# EAGLE design v0.9.1 (EAGLE 9.3.0)
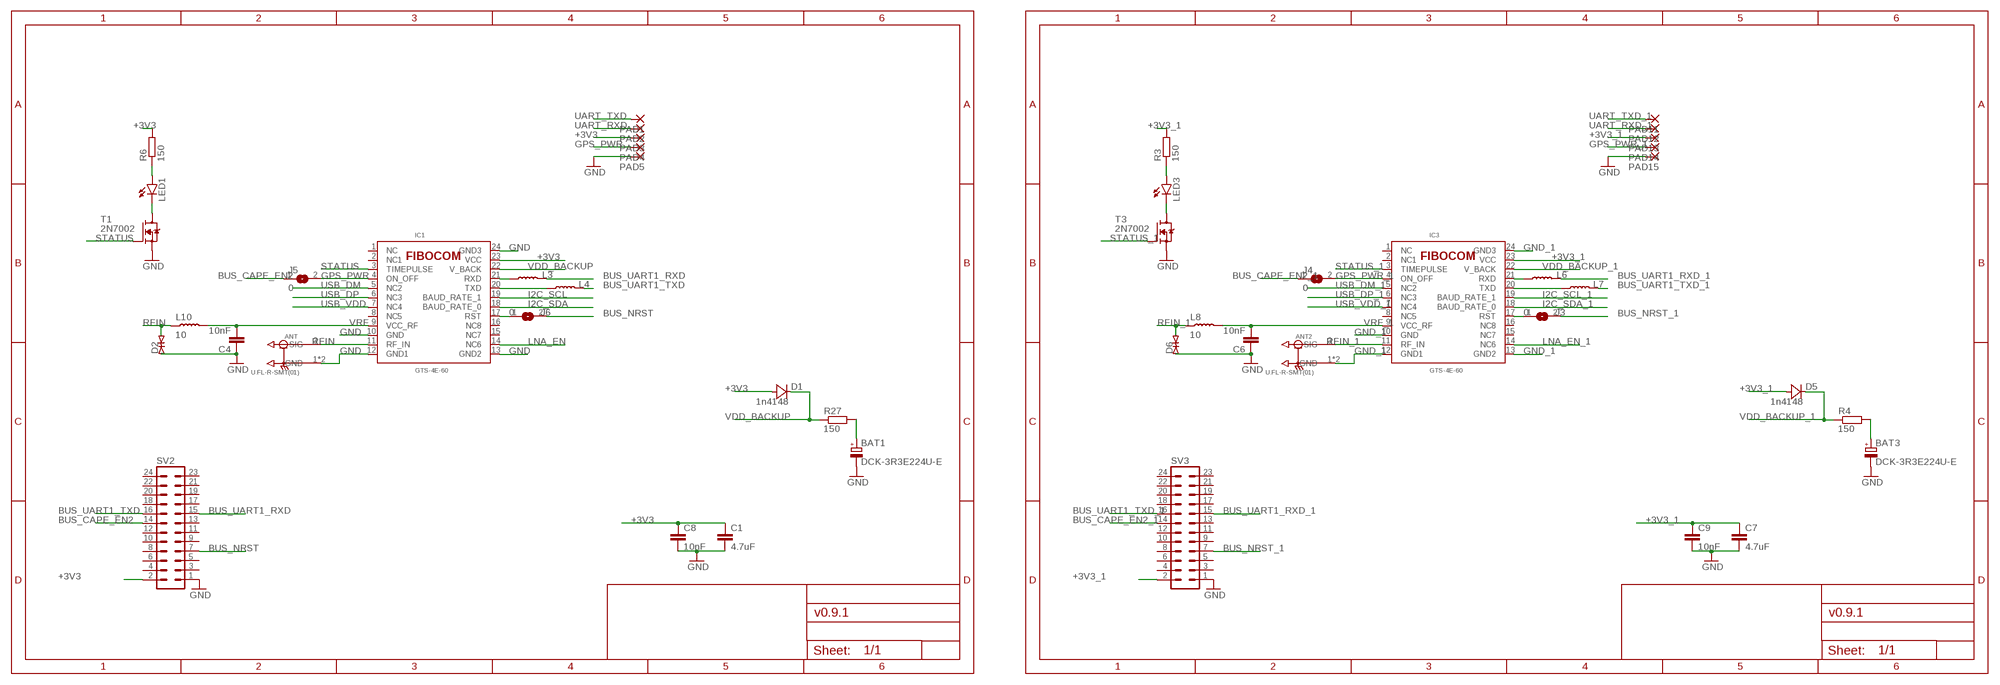
[diagram p0: schematic, sheet 1]

## Parts
ANT  U.FL-R-SMT(01)  [HRS_U.FL-R-SMT(01)]
ANT2  U.FL-R-SMT(01)  [HRS_U.FL-R-SMT(01)]
BAT1  DCK-3R3E224U-E  [621]
BAT3  DCK-3R3E224U-E  [621]
C1  4.7uF  CAP-0603  [C0603]
C4  10nF  CAP-0402  [C0402K]
C6  10nF  CAP-0402  [C0402K]
C7  4.7uF  CAP-0603  [C0603]
C8  10nF  CAP-0603  [C0603]
C9  10nF  CAP-0603  [C0603]
D1  1n4148  1N4148WS  [SOD323]
D2  ESD9B5.0ST5G  [SOD1006X40]
D5  1n4148  1N4148WS  [SOD323]
D6  ESD9B5.0ST5G  [SOD1006X40]
IC1  GTS-4E-60  [_GTS_4E_60]
IC3  GTS-4E-60  [_GTS_4E_60]
J3  0  JUMP-0603  [C0603]
J4  0  JUMP-0603  [C0603]
J5  0  JUMP-0603  [C0603]
J6  0  JUMP-0603  [C0603]
L3  blm15  IND-0402  [L0402]
L4  blm15  IND-0402  [L0402]
L6  blm15  IND-0402  [L0402]
L7  blm15  IND-0402  [L0402]
L8  10  IND-0402  [L0402]
L10  10  IND-0402  [L0402]
LED1  LEDCHIP-LED0603  [CHIP-LED0603]
LED3  LEDCHIP-LED0603  [CHIP-LED0603]
PAD1  1,6/0,9  [1,6/0,9]
PAD2  1,6/0,9  [1,6/0,9]
PAD3  1,6/0,9  [1,6/0,9]
PAD4  1,6/0,9  [1,6/0,9]
PAD5  1,6/0,9  [1,6/0,9]
PAD11  1,6/0,9  [1,6/0,9]
PAD12  1,6/0,9  [1,6/0,9]
PAD13  1,6/0,9  [1,6/0,9]
PAD14  1,6/0,9  [1,6/0,9]
PAD15  1,6/0,9  [1,6/0,9]
R3  150  RES-0603  [R0603]
R4  150  RES-0603  [R0603]
R6  150  RES-0603  [R0603]
R27  150  RES-0603  [R0603]
SV2  MA12-2  [MA12-2]
SV3  MA12-2  [MA12-2]
T1  2N7002  [SOT95P240X110-3]
T3  2N7002  [SOT95P240X110-3]

## Nets
+3V3: C1.1 C8.1 D1.A IC1.23(VCC) PAD3.1(P) R6.2 SV2.2
+3V3_1: C7.1 C9.1 D5.A IC3.23(VCC) PAD13.1(P) R3.2 SV3.2
BUS_CAPE_EN2: J5.1 SV2.14
BUS_CAPE_EN2_1: J4.1 SV3.14
BUS_NRST: J6.2 SV2.7
BUS_NRST_1: J3.2 SV3.7
BUS_UART1_RXD: L3.2 SV2.15
BUS_UART1_RXD_1: L6.2 SV3.15
BUS_UART1_TXD: L4.2 SV2.16
BUS_UART1_TXD_1: L7.2 SV3.16
GND: ANT.1(GND) ANT.2(GND) BAT1.- C1.2 C4.1 C8.2 D2.1(A) IC1.10(GND) IC1.12(GND1) IC1.13(GND2) IC1.24(GND3) PAD5.1(P) SV2.1 T1.2(S)
GND_1: ANT2.1(GND) ANT2.2(GND) BAT3.- C6.1 C7.2 C9.2 D6.1(A) IC3.10(GND) IC3.12(GND1) IC3.13(GND2) IC3.24(GND3) PAD15.1(P) SV3.1 T3.2(S) ; supply symbol labelled GND
GPS_PWR: IC1.4(ON_OFF) J5.2 PAD4.1(P)
GPS_PWR_1: IC3.4(ON_OFF) J4.2 PAD14.1(P)
I2C_SCL: IC1.19(BAUD_RATE_1)
I2C_SCL_1: IC3.19(BAUD_RATE_1)
I2C_SDA: IC1.18(BAUD_RATE_0)
I2C_SDA_1: IC3.18(BAUD_RATE_0)
LNA_EN: IC1.14(NC6)
LNA_EN_1: IC3.14(NC6)
N$5: BAT3.+ R4.2
N$6: LED1.C T1.3(D)
N$7: IC3.17(RST) J3.1
N$8: IC1.17(RST) J6.1
N$9: LED3.C T3.3(D)
N$10: LED3.A R3.1
N$12: LED1.A R6.1
N$20: BAT1.+ R27.2
RFIN: ANT.3(SIG) D2.2(C) IC1.11(RF_IN) L10.1
RFIN_1: ANT2.3(SIG) D6.2(C) IC3.11(RF_IN) L8.1
STATUS: IC1.3(TIMEPULSE) T1.1(G)
STATUS_1: IC3.3(TIMEPULSE) T3.1(G)
UART_RXD: IC1.20(TXD) L4.1 PAD2.1(P)
UART_RXD_1: IC3.20(TXD) L7.1 PAD12.1(P)
UART_TXD: IC1.21(RXD) L3.1 PAD1.1(P)
UART_TXD_1: IC3.21(RXD) L6.1 PAD11.1(P)
USB_DM: IC1.5(NC2)
USB_DM_1: IC3.5(NC2)
USB_DP: IC1.6(NC3)
USB_DP_1: IC3.6(NC3)
USB_VDD: IC1.7(NC4)
USB_VDD_1: IC3.7(NC4)
VDD_BACKUP: D1.K(C) IC1.22(V_BACK) R27.1
VDD_BACKUP_1: D5.K(C) IC3.22(V_BACK) R4.1
VRF: C4.2 IC1.9(VCC_RF) L10.2
VRF_1: C6.2 IC3.9(VCC_RF) L8.2
Unconnected: IC1.1(NC) IC1.2(NC1) IC1.8(NC5) IC1.15(NC7) IC1.16(NC8) IC3.1(NC) IC3.2(NC1) IC3.8(NC5) IC3.15(NC7) IC3.16(NC8) SV2.3 SV2.4 SV2.5 SV2.6 SV2.8 SV2.9 SV2.10 SV2.11 SV2.12 SV2.13 SV2.17 SV2.18 SV2.19 SV2.20 SV2.21 SV2.22 SV2.23 SV2.24 SV3.3 SV3.4 SV3.5 SV3.6 SV3.8 SV3.9 SV3.10 SV3.11 SV3.12 SV3.13 SV3.17 SV3.18 SV3.19 SV3.20 SV3.21 SV3.22 SV3.23 SV3.24

## Library data of the parts
ANT ANT2 = parts-molex:U.FL-R-SMT(01): U.FL Series 6 Ghz 50 Ohm Ultra-small SMT Coaxial Cable Receptacle; AVAILABILITY: Unavailable; DESCRIPTION: U.FL Series 6 Ghz 50 Ohm Ultra-small SMT Coaxial Cable Receptacle; MF: Hirose; MP: U.FL-R-SMT_01_; PACKAGE: None; PRICE: None
BAT1 BAT3 = parts-elna:DCK-3R3E224U-E
C1 C7-C9 = parts-passives:CAP-; PACKAGE: 0603; RATING: 10V
C4 C6 = parts-passives:CAP-; PACKAGE: 0402; RATING: 6V
D1 D5 = parts-diotec:1N4148WS
D2 D6 = parts-onsemi:ESD9B
IC1 IC3 = parts-fibocom:GTS-4E-60: The GTS-4E is a new generation of GPS receiving module. FIBOCOM GTS 4E 60
J3-J6 = parts-helpers:JUMP-
L3 L4 L6-L8 L10 = parts-passives:IND-; CURRENT: 10mA; PACKAGE: 0402
LED1 LED3 = led:LED: LED OSRAM: - CHIPLED LG R971, LG N971, LY N971, LG Q971, LY Q971, LO R971, LY R971 LH N974, LH R974 LS Q976, LO Q976, LY Q976 LO Q996 - Hyper CHIPLED LW Q18S LB Q993, LB Q99A, LB R99A - SideLED LS A670, LO A670, LY A670, LG A670, LP A670 LB A673, LV A673, LT A673, LW A673 LH A674 LY A675 LS A676, LA A676, LO A676, LY A676, LW A676 LS A679, LY A679, LG A679 - Hyper Micro SIDELED® LS Y876, LA Y876, LO Y876, LY Y876 LT Y87S - SmartLED LW L88C, LW L88S LB L89C, LB L89S, LG L890 LS L89K, LO L89K, LY L89K LS L896, LA L896, LO L896, LY L896 - TOPLED LS T670, LO T670, LY T670, LG T670, LP T670 LSG T670, LSP T670, LSY T670, LOP T670, LYG T670 LG T671, LOG T671, LSG T671 LB T673, LV T673, LT T673, LW T673 LH T674 LS T676, LA T676, LO T676, LY T676, LB T676, LH T676, LSB T676, LW T676 LB T67C, LV T67C, LT T67C, LS T67K, LO T67K, LY T67K, LW E67C LS E67B, LA E67B, LO E67B, LY E67B, LB E67C, LV E67C, LT E67C LW T67C LS T679, LY T679, LG T679 LS T770, LO T770, LY T770, LG T770, LP T770 LB T773, LV T773, LT T773, LW T773 LH T774 LS E675, LA E675, LY E675, LS T675 LS T776, LA T776, LO T776, LY T776, LB T776 LHGB T686 LT T68C, LB T68C - Hyper Mini TOPLED® LB M676 - Mini TOPLED Santana® LG M470 LS M47K, LO M47K, LY M47K Source: http://www.osram.convergy.de LUXEON: - LUMILED® LXK2-PW12-R00, LXK2-PW12-S00, LXK2-PW14-U00, LXK2-PW14-V00 LXK2-PM12-R00, LXK2-PM12-S00, LXK2-PM14-U00 LXK2-PE12-Q00, LXK2-PE12-R00, LXK2-PE12-S00, LXK2-PE14-T00, LXK2-PE14-U00 LXK2-PB12-K00, LXK2-PB12-L00, LXK2-PB12-M00, LXK2-PB14-N00, LXK2-PB14-P00, LXK2-PB14-Q00 LXK2-PR12-L00, LXK2-PR12-M00, LXK2-PR14-Q00, LXK2-PR14-R00 LXK2-PD12-Q00, LXK2-PD12-R00, LXK2-PD12-S00 LXK2-PH12-R00, LXK2-PH12-S00 LXK2-PL12-P00, LXK2-PL12-Q00, LXK2-PL12-R00 Source: www.luxeon.com KINGBRIGHT: KA-3528ASYC Source: www.kingbright.com
PAD1-PAD5 PAD11-PAD15 = wirepad:1,6/0,9: THROUGH-HOLE PAD
R3 R4 R6 R27 = parts-passives:RES-; PACKAGE: 0603
SV2 SV3 = con-lstb:MA12-2: PIN HEADER; OC_FARNELL: unknown; OC_NEWARK: unknown
T1 T3 = parts-onsemi:2N7002

## Net classes
1 50_feed: width 1 mm, clearance 0.4 mm
2 usb_dif: width 0.4 mm, clearance 0.8 mm

## Board
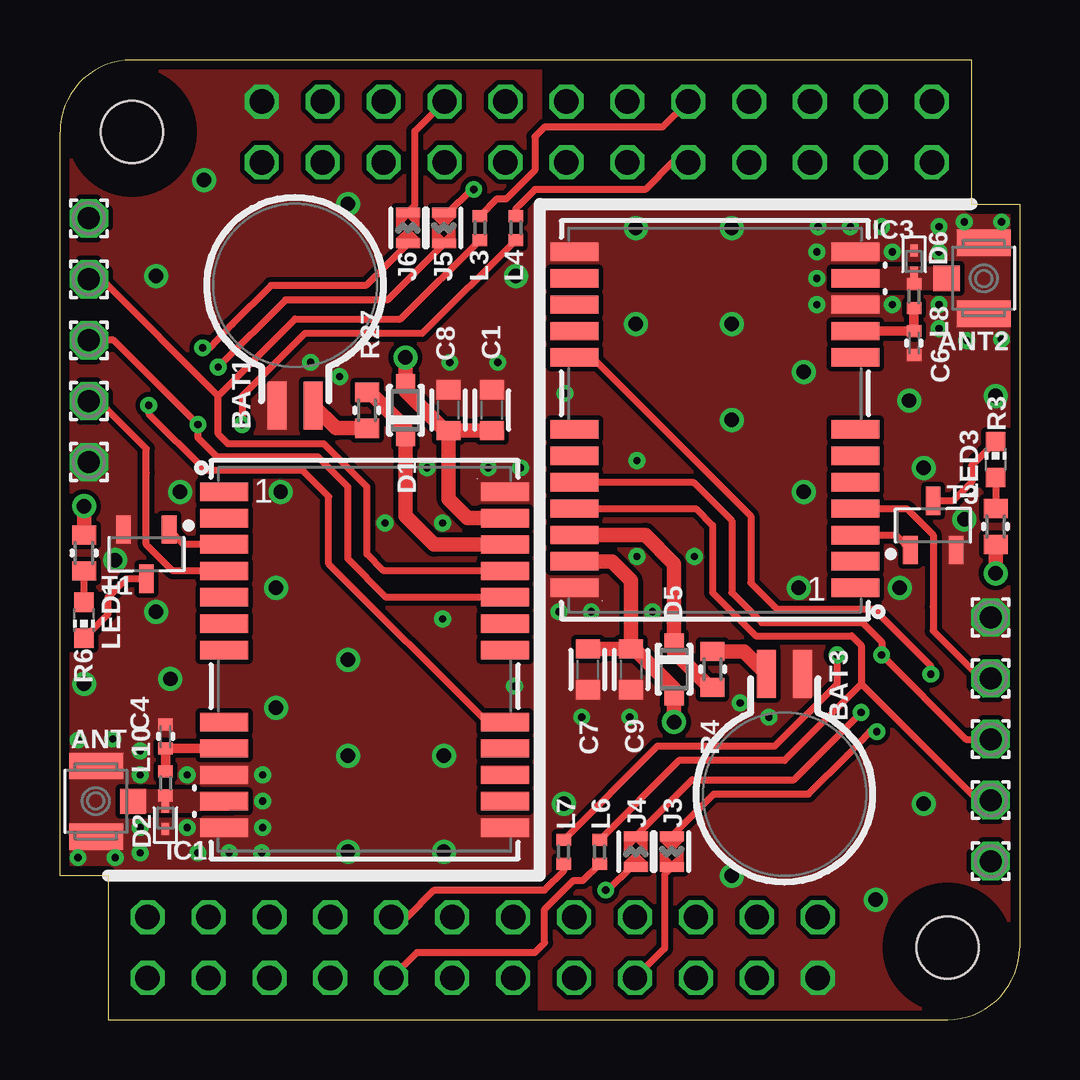
[diagram p1: board, top side]
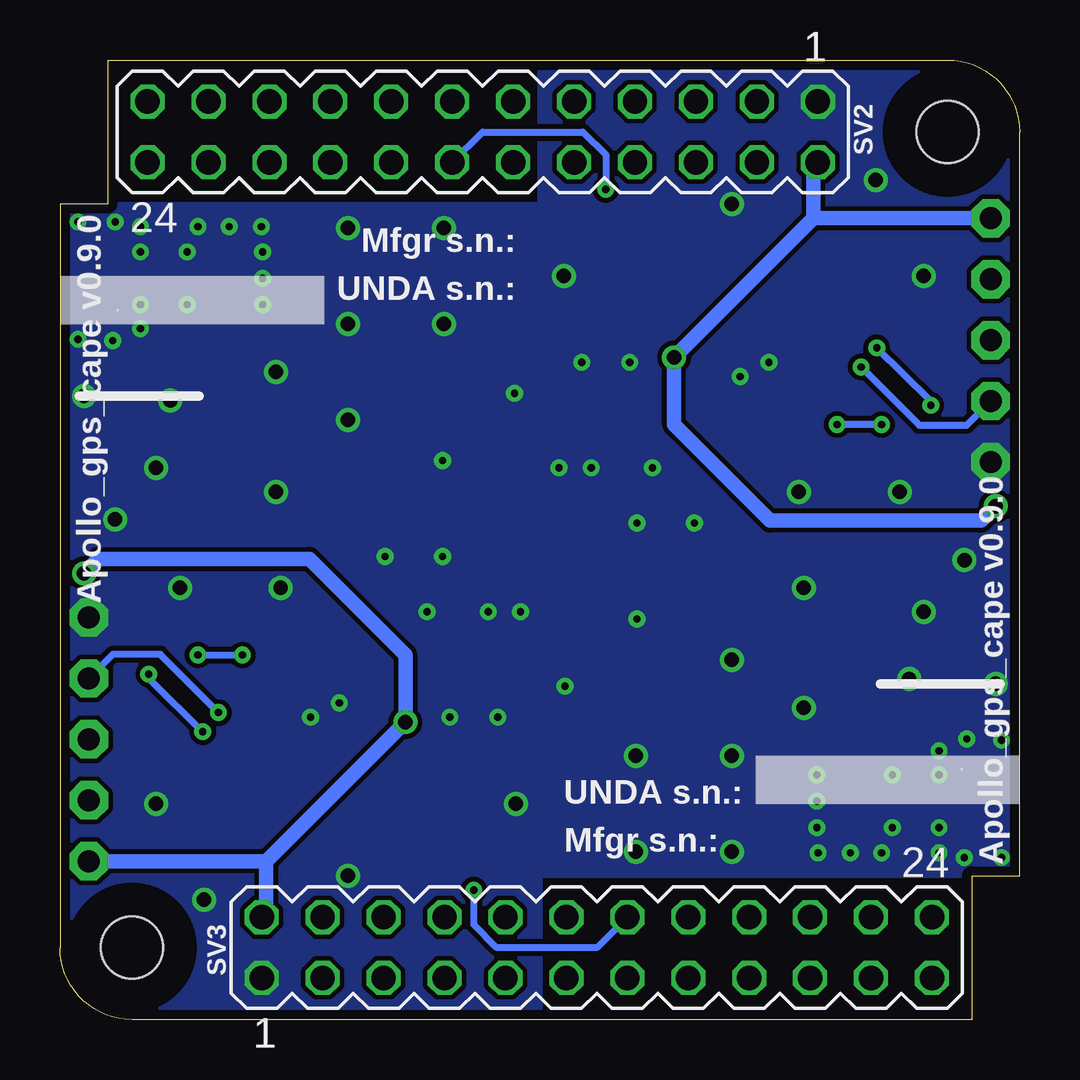
[diagram p2: board, bottom side, seen from below]

Size 40 x 40 mm. Coordinates in mm from the lower left corner, seen from the top.
Outline: 0,6 0,37 arc-90 3,40 38,40 38,34 40,34 40,3 arc-90 37,0 2,0 2,6 0,6
Copper layers (1*16): Top 0.035mm / dielectric 0.53mm / Bottom 0.035mm
Design rules "default *": minimum track width 0.2mm, minimum drill 0.3mm, track to track 0.2mm, track to pad 0.2mm, pad to pad 0.2mm, via to via 0.2mm, smd to smd 6mil, copper to edge 0.4mm, drill to drill 0.2mm, minimum pad ring 0.2mm, minimum via ring 0.2mm, stop-mask expansion 0.1mm, vias tented up to drill 0.6mm, thermal gap 10mil
Holes 2.6 mm at 3,37 37,3
tRestrict: area 0.5,34.5 to 5.5,39.5; area 34.5,0.5 to 39.5,5.5
bRestrict: area 0.5,34.5 to 5.5,39.5; area 34.5,0.5 to 39.5,5.5

### Footprints (pad centres in the part's own frame; a part is rotated, then mirrored left to right if it is on the bottom)
HRS_U.FL-R-SMT(01) = smd 1.1 x 2.25: 1 -1.475,0; 2 1.475,0 | smd 1.05 x 1.1: 3 0,-1.55
621 = smd 0.8 x 2: + 0.75,-1.6; - -0.75,-1.6
C0603 = smd 0.8 x 1: 1 -0.85,0; 2 0.85,0
C0402K = smd 0.5 x 0.6: 1 -0.5,0; 2 0.5,0
SOD323 = smd 0.8 x 0.8: A 1.1,0; K -1.1,0
SOD1006X40 = smd 0.495 x 0.32: 1 -0.453,0; 2 0.453,0
_GTS_4E_60 = smd 0.76 x 2: 1 -7,-5.85; 2 -5.9,-5.85; 3 -4.81,-5.85; 4 -3.7,-5.85; 5 -2.6,-5.85; 6 -1.5,-5.85; 7 -0.4,-5.85; 8 2.6,-5.85; 9 3.7,-5.85; 10 4.8,-5.85; 11 5.9,-5.85; 12 7,-5.85; 13 7,5.85; 14 5.9,5.85; 15 4.8,5.85; 16 3.7,5.85; 17 2.6,5.85; 18 -0.4,5.85; 19 -1.5,5.85; 20 -2.6,5.85; 21 -3.7,5.85; 22 -4.8,5.85; 23 -5.9,5.85; 24 -7,5.85
C0603' = smd 0.4 x 1: 1 -0.65,0; 2 0.65,0
L0402 = smd 0.5 x 0.6: 1 -0.5,0; 2 0.5,0
CHIP-LED0603 = smd 0.8 x 0.8: A 0,-0.75; C 0,0.75
1,6/0,9 = drill 0.914 pad 1.6 octagon: 1 0,0
R0603 = smd 0.8 x 1: 1 -0.75,0; 2 0.75,0
MA12-2 = drill 1.016 octagon: 1 -13.97,-1.27; 2 -13.97,1.27; 3 -11.43,-1.27; 4 -11.43,1.27; 5 -8.89,-1.27; 6 -8.89,1.27; 7 -6.35,-1.27; 8 -6.35,1.27; 9 -3.81,-1.27; 10 -3.81,1.27; 11 -1.27,-1.27; 12 -1.27,1.27; 13 1.27,-1.27; 14 1.27,1.27; 15 3.81,-1.27; 16 3.81,1.27; 17 6.35,-1.27; 18 6.35,1.27; 19 8.89,-1.27; 20 8.89,1.27; 21 11.43,-1.27; 22 11.43,1.27; 23 13.97,-1.27; 24 13.97,1.27
SOT95P240X110-3 = smd 1.18 x 0.609: 1 -1.024,0.95; 2 -1.024,-0.95; 3 1.024,0

### Placement (x,y rotation side)
ANT  1.5,9.1 90 top
ANT2  38.5,30.9 270 top
BAT1  9.8,27.2 0 top
BAT3  30.2,12.8 180 top
C1  18,25.4 90 top
C4  4.4,11.8 270 top
C6  35.6,28.2 90 top
C7  22,14.6 270 top
C8  16.2,25.4 90 top
C9  23.8,14.6 270 top
D1  14.4,25.4 90 top
D2  4.4,8.4 90 top
D5  25.6,14.6 270 top
D6  35.6,31.6 270 top
IC1  12.7,15 270 top
IC3  27.3,25 90 top
J3  0  [C0603']  25.5,7 270 top
J4  0  [C0603']  24,7 90 top
J5  0  [C0603']  16,33 270 top
J6  0  [C0603']  14.5,33 90 top
L3  17.5,33 90 top
L4  19,33 90 top
L6  22.5,7 270 top
L7  21,7 270 top
L8  35.6,30.15 270 top
L10  4.4,9.85 90 top
LED1  1,16.65 180 top
LED3  39,23.35 0 top
PAD1  1.2,30.86 0 top
PAD2  1.2,28.32 0 top
PAD3  1.2,33.4 0 top
PAD4  1.2,25.78 0 top
PAD5  1.2,23.24 0 top
PAD11  38.8,9.14 180 top
PAD12  38.8,11.68 180 top
PAD13  38.8,6.6 180 top
PAD14  38.8,14.22 180 top
PAD15  38.8,16.76 180 top
R3  39,20.55 270 top
R4  27.2,14.6 90 top
R6  1,19.45 90 top
R27  12.8,25.4 270 top
SV2  22.38,37 180 bottom
SV3  17.62,3 0 bottom
T1  3.6,19.4 270 top
T3  36.4,20.6 90 top

### Tracks (layer width: path | path; a pad name or v marks a point on that pad's centre or on a via)
+3V3  (via drill 0.6)
  Top 0.6: IC1.23 17,20.9 16.2,21.7 C8.1 | C1.1 C8.1 | C8.1 16.05,24.55 14.4,26.2 D1.A v14.4,27.6 | R6.2 v1,21.4
  Bottom 0.6: v1,21.4 1.6,20.8 10.4,20.8 14.4,24.8 v14.4,27.6 8.6,33.4 | 8.6,33.4 PAD3.1 | 8.6,33.4 8.6,35.54 SV2.2
+3V3_1  (via drill 0.6)
  Top 0.6: IC3.23 23,19.1 23.8,18.3 C9.1 | C7.1 C9.1 | C9.1 23.95,15.45 25.6,13.8 D5.A v25.6,12.4 | R3.2 v39,18.6
  Bottom 0.6: v39,18.6 38.4,19.2 29.6,19.2 25.6,15.2 v25.6,12.4 31.4,6.6 | 31.4,6.6 PAD13.1 | 31.4,6.6 31.4,4.46 SV3.2
BUS_CAPE_EN2  (via drill 0.3)
  Top 0.2: J5.1 16.2,33.65
  Top 0.3: v17.25,34.6 17.15,34.6 16.2,33.65
  Bottom 0.3: SV2.14 22.38,37 18.2,37 17.25,36.05 v17.25,34.6
BUS_CAPE_EN2_1  (via drill 0.3)
  Top 0.2: J4.1 23.8,6.35
  Top 0.3: v22.75,5.4 22.85,5.4 23.8,6.35
  Bottom 0.3: SV3.14 17.62,3 21.8,3 22.75,3.95 v22.75,5.4
BUS_NRST
  Top 0.3: SV2.7 14.8,37.04 14.8,33.95 J6.2
BUS_NRST_1
  Top 0.3: SV3.7 25.2,2.96 25.2,6.05 J3.2
BUS_UART1_RXD
  Top 0.3: SV2.15 25.12,37.2 20.2,37.2 19.8,36.8 19.8,35.4 18.6,34.2 18.2,34.2 L3.2
BUS_UART1_RXD_1
  Top 0.3: SV3.15 14.88,2.8 19.8,2.8 20.2,3.2 20.2,4.6 21.4,5.8 21.8,5.8 L6.2
BUS_UART1_TXD
  Top 0.3: SV2.16 25.53,35.73 24.4,34.6 19.8,34.6 19,33.8 L4.2
BUS_UART1_TXD_1
  Top 0.3: SV3.16 14.47,4.27 15.6,5.4 20.2,5.4 21,6.2 L7.2
GND  (via drill 0.3, 0.6)
  other vias: 5.3,10.2 5.3,8 3.35,10.2 3.35,8 3.35,6.95 0.75,6.75 2.3,6.75 0.75,11.65 2.2,11.7 3.35,11.2 8.45,10.2 8.45,9.1 8.45,8 8.4,6.95 7.05,6.95 5.75,6.95 19.2,23 17.85,23 15.3,23 15.95,20.7 13.55,20.7 15.95,16.7 18.95,13.9 18.25,27.4 16.25,27.4 11.65,26.8 10.45,27.4 9.2,22 9,13 16,7 12,7 12,11 16,11 12,15 4,17 1,14 9,18 5,22 4,31 12,34 19,31 6,35 4.6,14.2 2.3,19.15
  pour Bottom (isolate 0.2, no thermals): -1,6 20,6 20,41 -1,41
  pour Top (isolate 0.2, rank 6, no thermals): -2,6 20,6 20,42 -2,42
GND_1  (via drill 0.3, 0.6)
  other vias: 34.7,29.8 34.7,32 36.65,29.8 36.65,32 36.65,33.05 39.25,33.25 37.7,33.25 39.25,28.35 37.8,28.3 36.65,28.8 31.55,29.8 31.55,30.9 31.55,32 31.6,33.05 32.95,33.05 34.25,33.05 20.8,17 22.15,17 24.7,17 24.05,19.3 26.45,19.3 24.05,23.3 21.05,26.1 21.75,12.6 23.75,12.6 28.35,13.2 29.55,12.6 30.8,18 31,27 24,33 28,33 28,29 24,29 28,25 36,23 39,26 31,22 35,18 36,9 28,6 21,9 34,5 35.4,25.8 37.7,20.85
  pour Bottom (isolate 0.2, no thermals): 41,34 20,34 20,-1 41,-1
  pour Top (isolate 0.2, rank 6, no thermals): 42,34 20,34 20,-2 42,-2
GPS_PWR  (via drill 0.3)
  Top 0.3: IC1.4 4.7,18.7 3.6,19.8 3.6,22.8 3.6,23.8 1.62,25.78 PAD4.1 | J5.2 13.65,30 9.4,30 v6.6,27.2
  Bottom 0.3: v6.6,27.2 4.18,24.78 2.2,24.78 PAD4.1
GPS_PWR_1  (via drill 0.3)
  Top 0.3: IC3.4 35.3,21.3 36.4,20.2 36.4,17.2 36.4,16.2 38.38,14.22 PAD14.1 | J4.2 26.35,10 30.6,10 v33.4,12.8
  Bottom 0.3: v33.4,12.8 35.82,15.22 37.8,15.22 PAD14.1
N$5
  Top 0.6: R4.2 28.5,15.35 BAT3.+
N$6
  Top 0.3: LED1.C 2,16.9 2,17.6 2.78,18.38 T1.3
N$7  (via drill 0.3)
  Top 0.3: IC3.17 22.2,27.6 28.8,21 28.8,18.2 29.9,17.1 33.95,17.1 36.3,14.75 v36.3,14.4 | J3.1 27.25,9.4 31.2,9.4 32.82,11.02 33.76,12 v34.05,12
  Bottom 0.3: v36.3,14.4 36.28,14.2 v34.05,12
N$8  (via drill 0.3)
  Top 0.3: IC1.17 17.8,12.4 11.2,19 11.2,21.8 10.1,22.9 6.05,22.9 3.7,25.25 v3.7,25.6 | J6.1 12.75,30.6 8.8,30.6 7.18,28.98 6.25,28 v5.95,28
  Bottom 0.3: v3.7,25.6 3.72,25.8 v5.95,28
N$9
  Top 0.3: LED3.C 38,23.1 38,22.4 37.22,21.62 T3.3
N$10
  Top 0.3: LED3.A R3.1
N$12
  Top 0.3: LED1.A R6.1
N$20
  Top 0.6: R27.2 11.5,24.65 BAT1.+
RFIN
  pour Top (no thermals): 2.9,9.55 2.9,8.65 5.65,8.65 5.75,8.75 7,8.75 7,9.45 5.7,9.45 5.6,9.55
RFIN_1
  pour Top (no thermals): 37.1,30.45 37.1,31.35 34.35,31.35 34.25,31.25 33,31.25 33,30.55 34.3,30.55 34.4,30.45
STATUS
  Top 0.3: IC1.3 5.16,19.81 T1.1
STATUS_1
  Top 0.3: IC3.3 34.84,20.19 T3.1
UART_RXD  (via drill 0.3)
  Top 0.3: IC1.20 13.6,17.6 12,19.2 12,22.2 10.75,23.45 6.55,23.45 5.75,24.25 v5.75,24.8 2.23,28.32 PAD2.1 | L4.1 15.1,28.6 10.2,28.6 7.6,26 v7.6,24.8
  Bottom 0.3: v5.75,24.8 v7.6,24.8
UART_RXD_1  (via drill 0.3)
  Top 0.3: IC3.20 26.4,22.4 28,20.8 28,17.8 29.25,16.55 33.45,16.55 34.25,15.75 v34.25,15.2 37.77,11.68 PAD12.1 | L7.1 24.9,11.4 29.8,11.4 32.4,14 v32.4,15.2
  Bottom 0.3: v34.25,15.2 v32.4,15.2
UART_TXD
  Top 0.3: IC1.21 13.5,18.7 12.8,19.4 12.8,22.2 11,24 7,24 6.6,24.4 6.6,26 | L3.1 14.2,29.2 9.8,29.2 6.6,26 | 6.6,26 1.74,30.86 PAD1.1
UART_TXD_1
  Top 0.3: IC3.21 26.5,21.3 27.2,20.6 27.2,17.8 29,16 33,16 33.4,15.6 33.4,14 | L6.1 25.8,10.8 30.2,10.8 33.4,14 | 33.4,14 38.26,9.14 PAD11.1
VDD_BACKUP
  Top 0.6: IC1.22 15.6,19.8 14.4,21 D1.K 14.4,24.66 12.91,26.15 R27.1
VDD_BACKUP_1
  Top 0.6: IC3.22 24.4,20.2 25.6,19 D5.K 25.6,15.34 27.09,13.85 R4.1
VRF
  Top 0.4: IC1.9 C4.2 | C4.2 | C4.2 L10.2
VRF_1
  Top 0.4: IC3.9 C6.2 | C6.2 | C6.2 L8.2

### Text on the board
bNames: Apollo_gps_cape v0.9.0 | Mfgr s.n.: | UNDA s.n.: | UNDA s.n.: | Mfgr s.n.: | Apollo_gps_cape v0.9.0